# Altium project 5_Volts_and_3.3_Volts_Power_Supply.PrjPcb
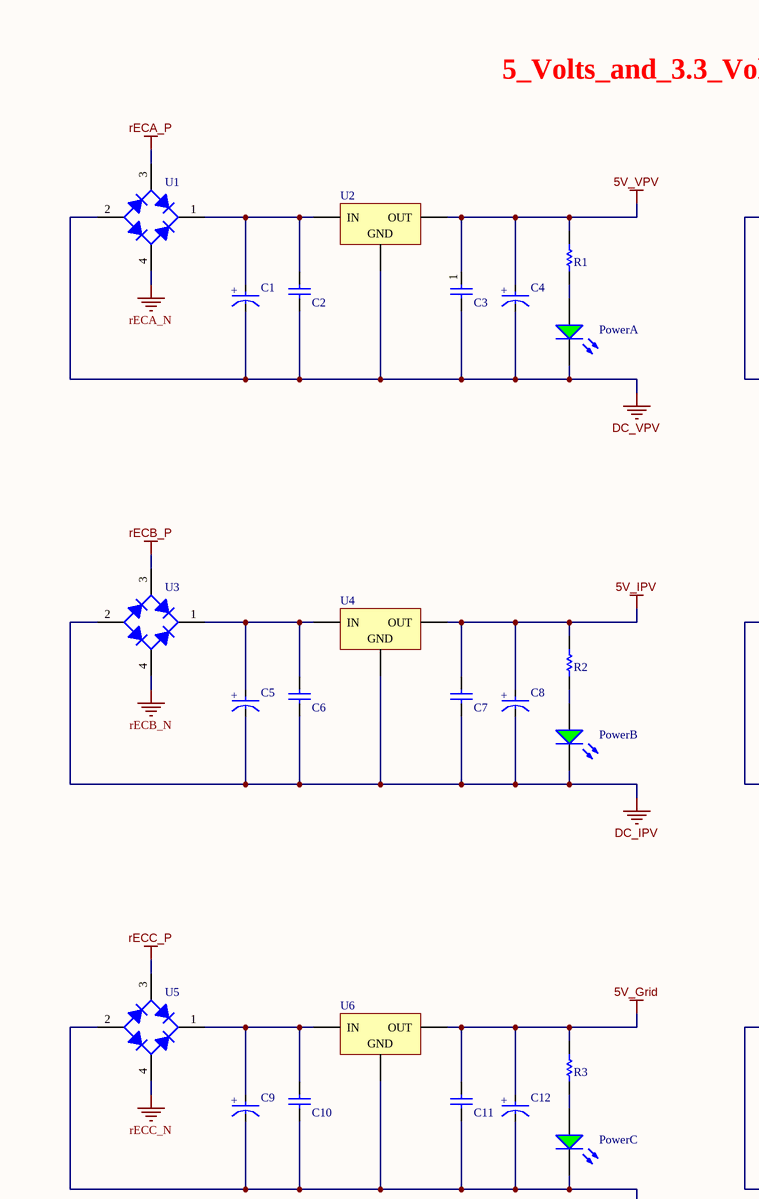
[diagram p0: 5_Volts_and_3.3_Volts_Power_Supply.SchDoc, top left]
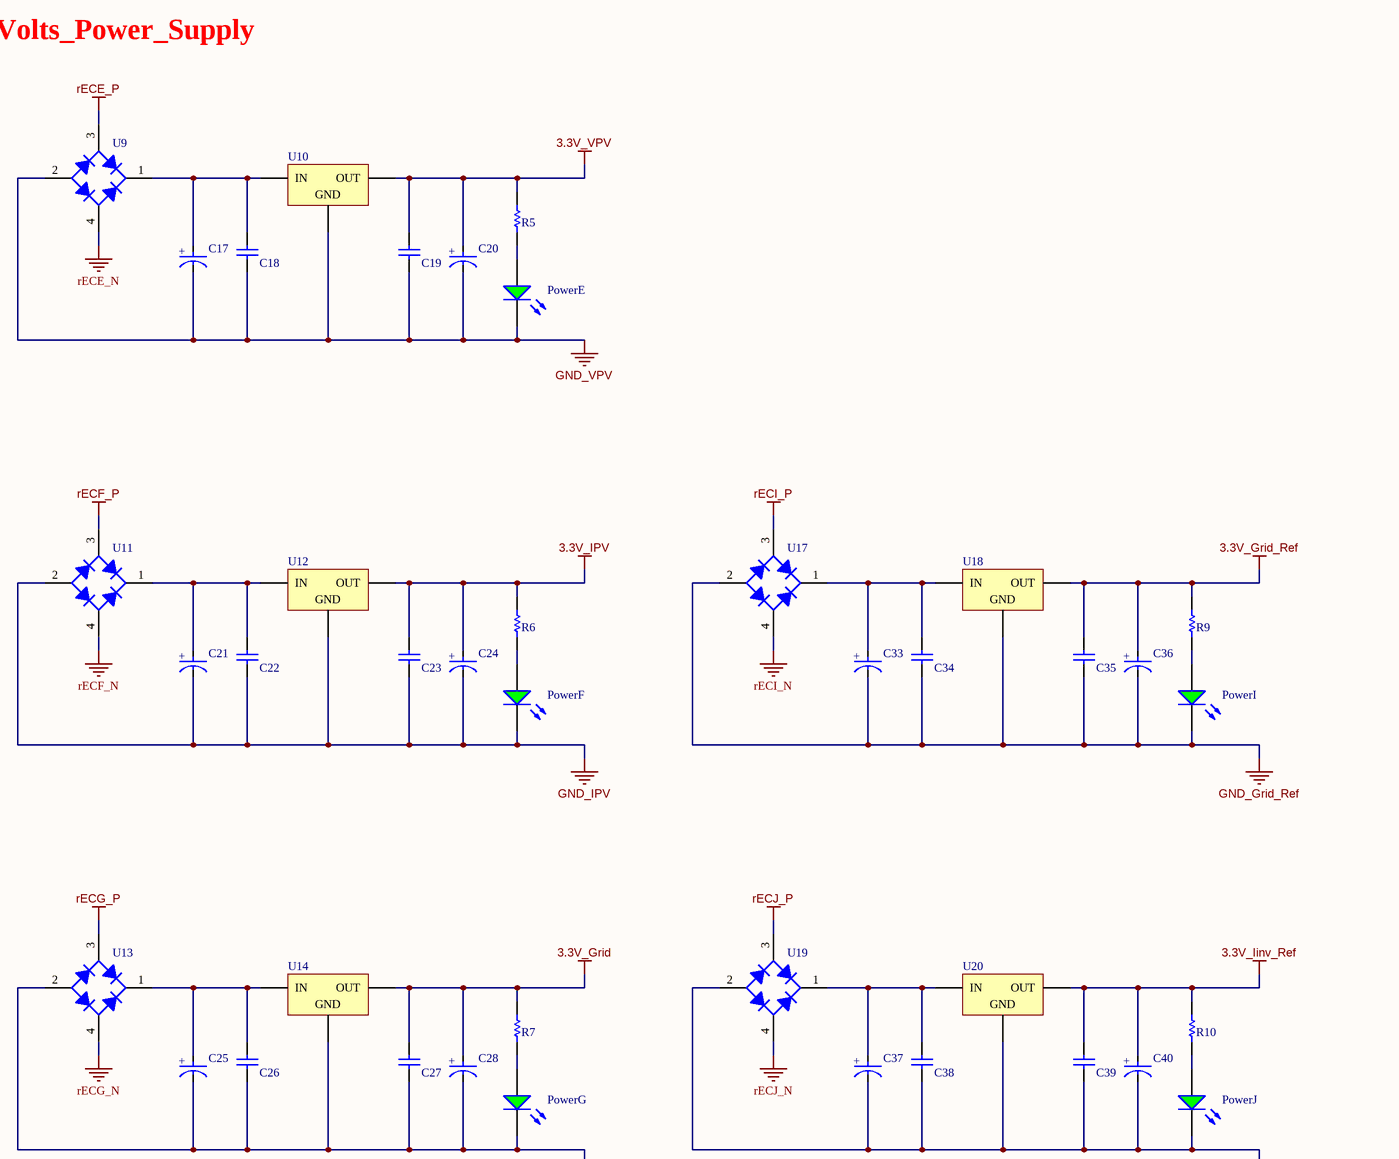
[diagram p1: 5_Volts_and_3.3_Volts_Power_Supply.SchDoc, top right]
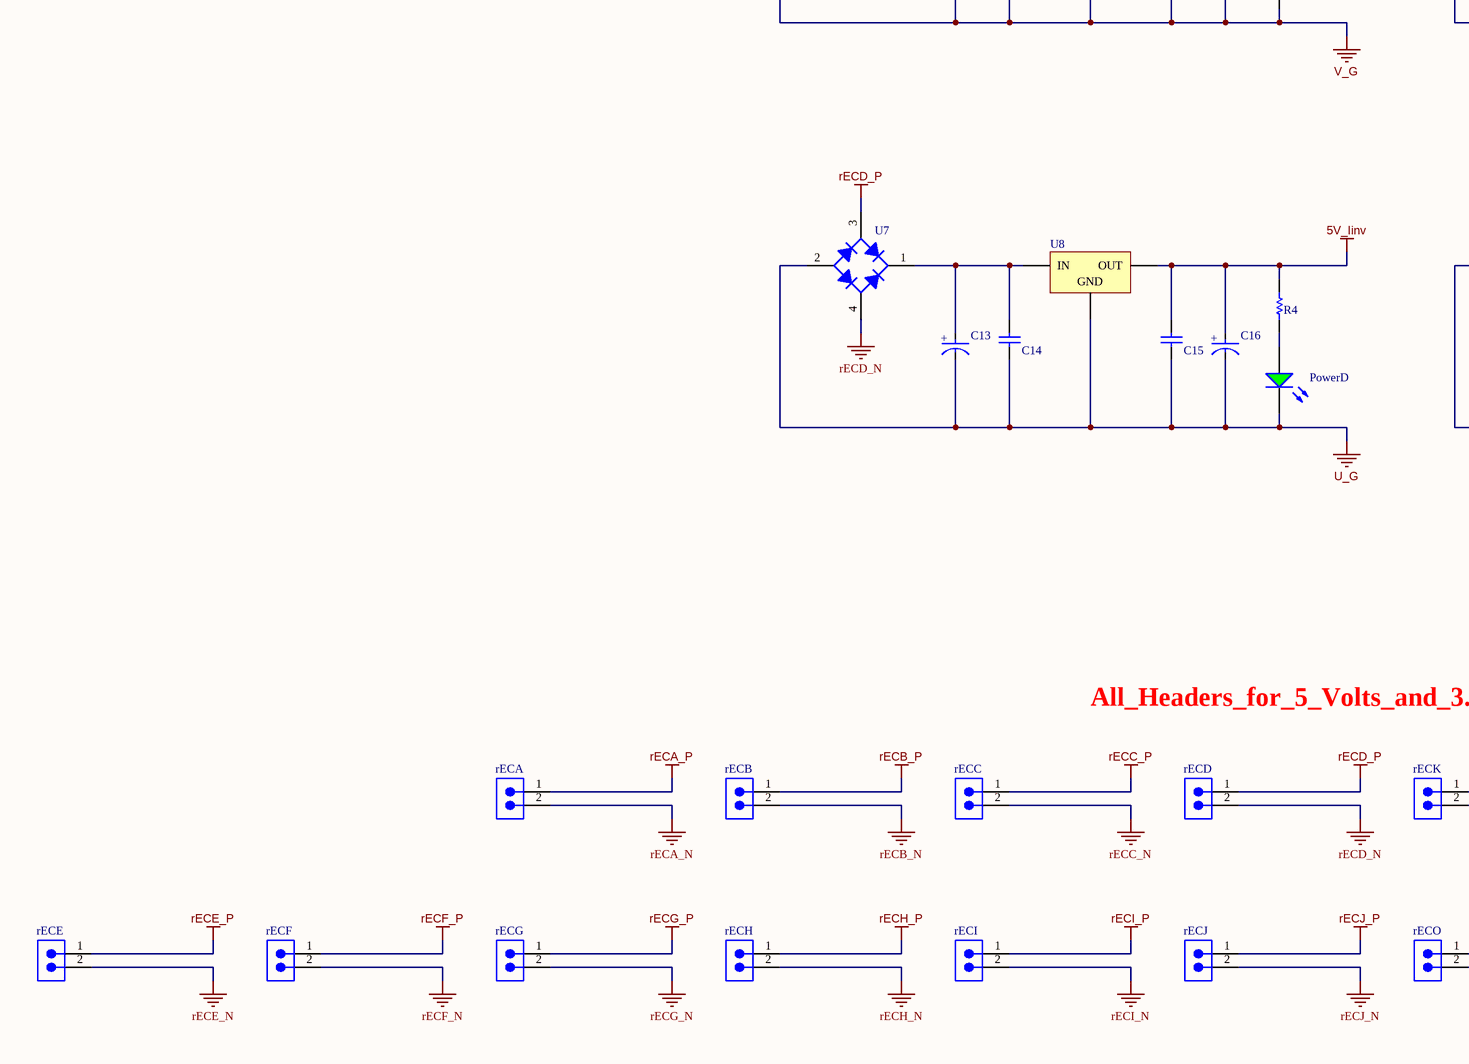
[diagram p2: 5_Volts_and_3.3_Volts_Power_Supply.SchDoc, bottom left]
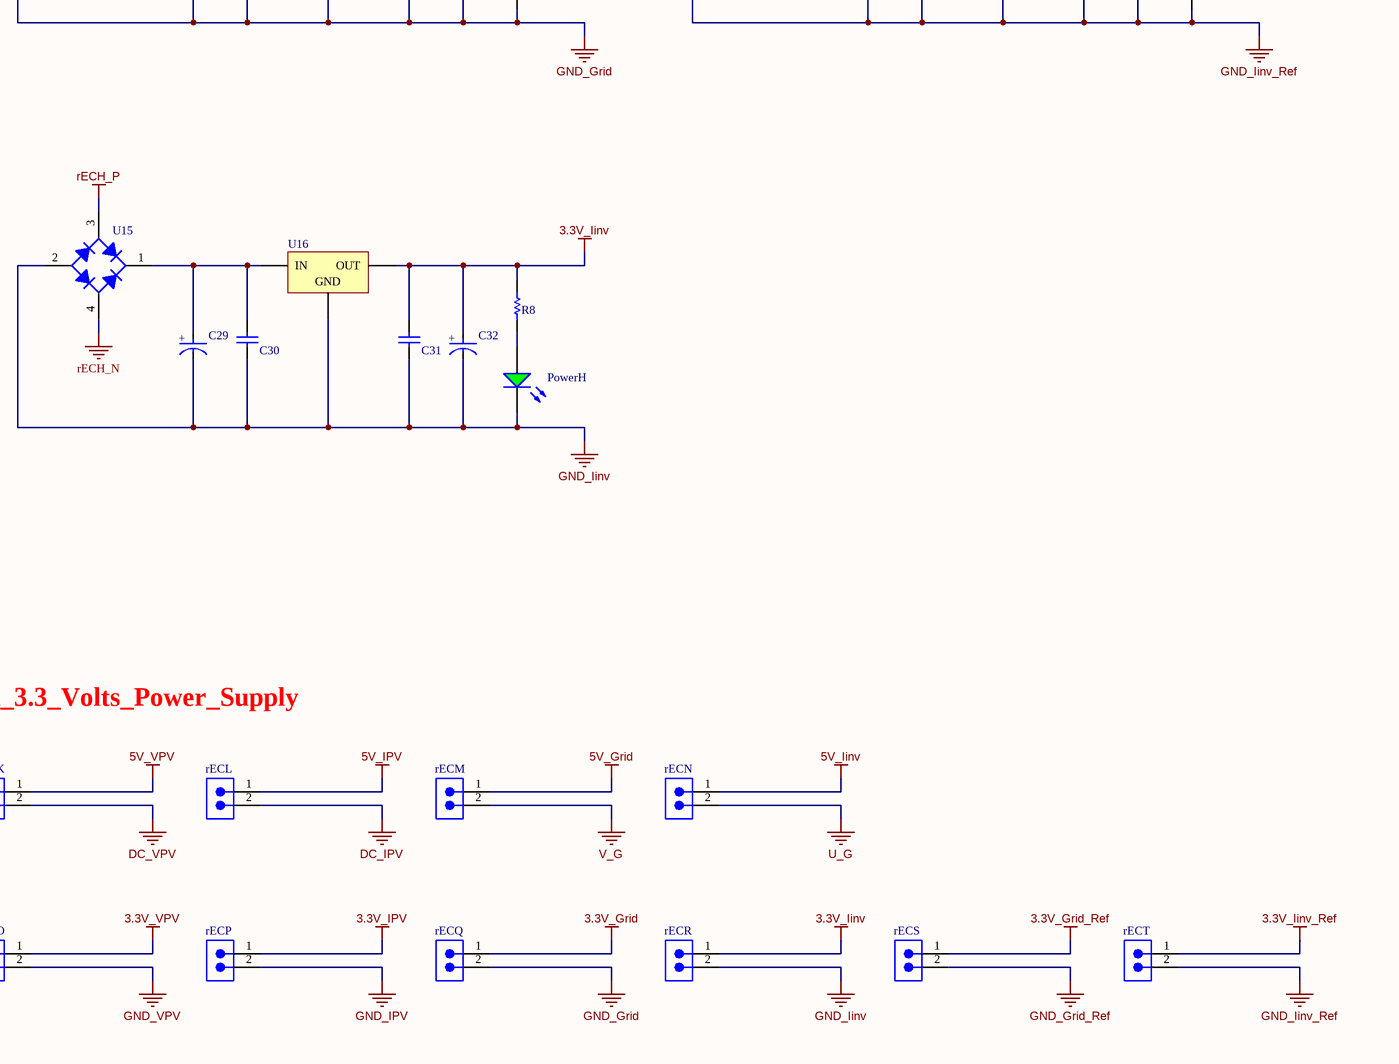
[diagram p3: 5_Volts_and_3.3_Volts_Power_Supply.SchDoc, bottom right]
1 sheet, 100 parts. Net scope: global (net labels, ports and power ports of the same name join across sheets).
Board file: 5_Volts_and_3.3_Volts_Power_Supply.PcbDoc

## Sheet 5_Volts_and_3.3_Volts_Power_Supply.SchDoc
size A1; SheetNumber: 1; SheetTotal: 1

### Parts
C1  EEE-FK1H471AM  [FP-FKJ16-MFG]  (value not drawn)
C2  GRM219R71H334KA88D  [CAPC2013X95X45ML10T25]  (value not drawn)
C3  GRM21BR71H104KA01L  [CAPC2013X135X45ML10T25]  (value not drawn)
C4  EEE-FK1H100UR  [FP-FKC-MFG]  (value not drawn)
C5  EEE-FK1H471AM  [FP-FKJ16-MFG]  (value not drawn)
C6  GRM219R71H334KA88D  [CAPC2013X95X45ML10T25]  (value not drawn)
C7  GRM21BR71H104KA01L  [CAPC2013X135X45ML10T25]  (value not drawn)
C8  EEE-FK1H100UR  [FP-FKC-MFG]  (value not drawn)
C9  EEE-FK1H471AM  [FP-FKJ16-MFG]  (value not drawn)
C10  GRM219R71H334KA88D  [CAPC2013X95X45ML10T25]  (value not drawn)
C11  GRM21BR71H104KA01L  [CAPC2013X135X45ML10T25]  (value not drawn)
C12  EEE-FK1H100UR  [FP-FKC-MFG]  (value not drawn)
C13  EEE-FK1H471AM  [FP-FKJ16-MFG]  (value not drawn)
C14  GRM219R71H334KA88D  [CAPC2013X95X45ML10T25]  (value not drawn)
C15  GRM21BR71H104KA01L  [CAPC2013X135X45ML10T25]  (value not drawn)
C16  EEE-FK1H100UR  [FP-FKC-MFG]  (value not drawn)
C17  EEE-FK1H471AM  [FP-FKJ16-MFG]  (value not drawn)
C18  GRM219R71H334KA88D  [CAPC2013X95X45ML10T25]  (value not drawn)
C19  GRM21BR71H104KA01L  [CAPC2013X135X45ML10T25]  (value not drawn)
C20  EEE-FK1H100UR  [FP-FKC-MFG]  (value not drawn)
C21  EEE-FK1H471AM  [FP-FKJ16-MFG]  (value not drawn)
C22  GRM219R71H334KA88D  [CAPC2013X95X45ML10T25]  (value not drawn)
C23  GRM21BR71H104KA01L  [CAPC2013X135X45ML10T25]  (value not drawn)
C24  EEE-FK1H100UR  [FP-FKC-MFG]  (value not drawn)
C25  EEE-FK1H471AM  [FP-FKJ16-MFG]  (value not drawn)
C26  GRM219R71H334KA88D  [CAPC2013X95X45ML10T25]  (value not drawn)
C27  GRM21BR71H104KA01L  [CAPC2013X135X45ML10T25]  (value not drawn)
C28  EEE-FK1H100UR  [FP-FKC-MFG]  (value not drawn)
C29  EEE-FK1H471AM  [FP-FKJ16-MFG]  (value not drawn)
C30  GRM219R71H334KA88D  [CAPC2013X95X45ML10T25]  (value not drawn)
C31  GRM21BR71H104KA01L  [CAPC2013X135X45ML10T25]  (value not drawn)
C32  EEE-FK1H100UR  [FP-FKC-MFG]  (value not drawn)
C33  EEE-FK1H471AM  [FP-FKJ16-MFG]  (value not drawn)
C34  GRM219R71H334KA88D  [CAPC2013X95X45ML10T25]  (value not drawn)
C35  GRM21BR71H104KA01L  [CAPC2013X135X45ML10T25]  (value not drawn)
C36  EEE-FK1H100UR  [FP-FKC-MFG]  (value not drawn)
C37  EEE-FK1H471AM  [FP-FKJ16-MFG]  (value not drawn)
C38  GRM219R71H334KA88D  [CAPC2013X95X45ML10T25]  (value not drawn)
C39  GRM21BR71H104KA01L  [CAPC2013X135X45ML10T25]  (value not drawn)
C40  EEE-FK1H100UR  [FP-FKC-MFG]  (value not drawn)
PowerA  150080GS75000  [WL-SMCW_0805_150080xx75000]  (value not drawn)
PowerB  150080GS75000  [WL-SMCW_0805_150080xx75000]  (value not drawn)
PowerC  150080GS75000  [WL-SMCW_0805_150080xx75000]  (value not drawn)
PowerD  150080GS75000  [WL-SMCW_0805_150080xx75000]  (value not drawn)
PowerE  150080GS75000  [WL-SMCW_0805_150080xx75000]  (value not drawn)
PowerF  150080GS75000  [WL-SMCW_0805_150080xx75000]  (value not drawn)
PowerG  150080GS75000  [WL-SMCW_0805_150080xx75000]  (value not drawn)
PowerH  150080GS75000  [WL-SMCW_0805_150080xx75000]  (value not drawn)
PowerI  150080GS75000  [WL-SMCW_0805_150080xx75000]  (value not drawn)
PowerJ  150080GS75000  [WL-SMCW_0805_150080xx75000]  (value not drawn)
R1  ERJ-6ENF1001V  [RESC2013X70X40ML20T20]  (value not drawn)
R2  ERJ-6ENF1001V  [RESC2013X70X40ML20T20]  (value not drawn)
R3  ERJ-6ENF1001V  [RESC2013X70X40ML20T20]  (value not drawn)
R4  ERJ-6ENF1001V  [RESC2013X70X40ML20T20]  (value not drawn)
R5  ERJ-6ENF1001V  [RESC2013X70X40ML20T20]  (value not drawn)
R6  ERJ-6ENF1001V  [RESC2013X70X40ML20T20]  (value not drawn)
R7  ERJ-6ENF1001V  [RESC2013X70X40ML20T20]  (value not drawn)
R8  ERJ-6ENF1001V  [RESC2013X70X40ML20T20]  (value not drawn)
R9  ERJ-6ENF1001V  [RESC2013X70X40ML20T20]  (value not drawn)
R10  ERJ-6ENF1001V  [RESC2013X70X40ML20T20]  (value not drawn)
rECA  61900211121  [61900211121]  (value not drawn)
rECB  61900211121  [61900211121]  (value not drawn)
rECC  61900211121  [61900211121]  (value not drawn)
rECD  61900211121  [61900211121]  (value not drawn)
rECE  61900211121  [61900211121]  (value not drawn)
rECF  61900211121  [61900211121]  (value not drawn)
rECG  61900211121  [61900211121]  (value not drawn)
rECH  61900211121  [61900211121]  (value not drawn)
rECI  61900211121  [61900211121]  (value not drawn)
rECJ  61900211121  [61900211121]  (value not drawn)
rECK  61900211121  [61900211121]  (value not drawn)
rECL  61900211121  [61900211121]  (value not drawn)
rECM  61900211121  [61900211121]  (value not drawn)
rECN  61900211121  [61900211121]  (value not drawn)
rECO  61900211121  [61900211121]  (value not drawn)
rECP  61900211121  [61900211121]  (value not drawn)
rECQ  61900211121  [61900211121]  (value not drawn)
rECR  61900211121  [61900211121]  (value not drawn)
rECS  61900211121  [61900211121]  (value not drawn)
rECT  61900211121  [61900211121]  (value not drawn)
U1  DF10S  [FAIR-SDIP-4_V]  (value not drawn)
U2  L78M05CDT-TR  [TO-252_L]  (value not drawn)
U3  DF10S  [FAIR-SDIP-4_V]  (value not drawn)
U4  L78M05CDT-TR  [TO-252_L]  (value not drawn)
U5  DF10S  [FAIR-SDIP-4_V]  (value not drawn)
U6  L78M05CDT-TR  [TO-252_L]  (value not drawn)
U7  DF10S  [FAIR-SDIP-4_V]  (value not drawn)
U8  L78M05CDT-TR  [TO-252_L]  (value not drawn)
U9  DF10S  [FAIR-SDIP-4_V]  (value not drawn)
U10  LF33ABDT-TR  [TO-252_N]  (value not drawn)
U11  DF10S  [FAIR-SDIP-4_V]  (value not drawn)
U12  LF33ABDT-TR  [TO-252_N]  (value not drawn)
U13  DF10S  [FAIR-SDIP-4_V]  (value not drawn)
U14  LF33ABDT-TR  [TO-252_N]  (value not drawn)
U15  DF10S  [FAIR-SDIP-4_V]  (value not drawn)
U16  LF33ABDT-TR  [TO-252_N]  (value not drawn)
U17  DF10S  [FAIR-SDIP-4_V]  (value not drawn)
U18  LF33ABDT-TR  [TO-252_N]  (value not drawn)
U19  DF10S  [FAIR-SDIP-4_V]  (value not drawn)
U20  LF33ABDT-TR  [TO-252_N]  (value not drawn)

### Nets
3.3V_Grid: C27.1 C28.2(A) R7.1 rECQ.1 U14.3(OUT)
3.3V_Grid_Ref: C35.1 C36.2(A) R9.1 rECS.1 U18.3(OUT)
3.3V_Iinv: C31.1 C32.2(A) R8.1 rECR.1 U16.3(OUT)
3.3V_Iinv_Ref: C39.1 C40.2(A) R10.1 rECT.1 U20.3(OUT)
3.3V_IPV: C23.1 C24.2(A) R6.1 rECP.1 U12.3(OUT)
3.3V_VPV: C19.1 C20.2(A) R5.1 rECO.1 U10.3(OUT)
5V_Grid: C11.1 C12.2(A) R3.1 rECM.1 U6.3(OUT)
5V_Iinv: C15.1 C16.2(A) R4.1 rECN.1 U8.3(OUT)
5V_IPV: C7.1 C8.2(A) R2.1 rECL.1 U4.3(OUT)
5V_VPV: C3.1 C4.2(A) R1.1 rECK.1 U2.3(OUT)
DC_IPV: C5.1(C) C6.2 C7.2 C8.1(C) PowerB.1(K) rECL.2 U3.2(A) U4.4(GND)
DC_VPV: C1.1(C) C2.2 C3.2 C4.1(C) PowerA.1(K) rECK.2 U1.2(A) U2.4(GND)
GND_Grid: C25.1(C) C26.2 C27.2 C28.1(C) PowerG.1(K) rECQ.2 U13.2(A) U14.4(GND)
GND_Grid_Ref: C33.1(C) C34.2 C35.2 C36.1(C) PowerI.1(K) rECS.2 U17.2(A) U18.4(GND)
GND_Iinv: C29.1(C) C30.2 C31.2 C32.1(C) PowerH.1(K) rECR.2 U15.2(A) U16.4(GND)
GND_Iinv_Ref: C37.1(C) C38.2 C39.2 C40.1(C) PowerJ.1(K) rECT.2 U19.2(A) U20.4(GND)
GND_IPV: C21.1(C) C22.2 C23.2 C24.1(C) PowerF.1(K) rECP.2 U11.2(A) U12.4(GND)
GND_VPV: C17.1(C) C18.2 C19.2 C20.1(C) PowerE.1(K) rECO.2 U9.2(A) U10.4(GND)
rECA_N: rECA.2 U1.4(C)
rECA_P: rECA.1 U1.3(C)
rECB_N: rECB.2 U3.4(C)
rECB_P: rECB.1 U3.3(C)
rECC_N: rECC.2 U5.4(C)
rECC_P: rECC.1 U5.3(C)
rECD_N: rECD.2 U7.4(C)
rECD_P: rECD.1 U7.3(C)
rECE_N: rECE.2 U9.4(C)
rECE_P: rECE.1 U9.3(C)
rECF_N: rECF.2 U11.4(C)
rECF_P: rECF.1 U11.3(C)
rECG_N: rECG.2 U13.4(C)
rECG_P: rECG.1 U13.3(C)
rECH_N: rECH.2 U15.4(C)
rECH_P: rECH.1 U15.3(C)
rECI_N: rECI.2 U17.4(C)
rECI_P: rECI.1 U17.3(C)
rECJ_N: rECJ.2 U19.4(C)
rECJ_P: rECJ.1 U19.3(C)
U_G: C13.1(C) C14.2 C15.2 C16.1(C) PowerD.1(K) rECN.2 U7.2(A) U8.4(GND)
V_G: C9.1(C) C10.2 C11.2 C12.1(C) PowerC.1(K) rECM.2 U5.2(A) U6.4(GND)
NetC1_2: C1.2(A) C2.1 U1.1(K) U2.1(IN)
NetC5_2: C5.2(A) C6.1 U3.1(K) U4.1(IN)
NetC9_2: C9.2(A) C10.1 U5.1(K) U6.1(IN)
NetC13_2: C13.2(A) C14.1 U7.1(K) U8.1(IN)
NetC17_2: C17.2(A) C18.1 U9.1(K) U10.1(IN)
NetC21_2: C21.2(A) C22.1 U11.1(K) U12.1(IN)
NetC25_2: C25.2(A) C26.1 U13.1(K) U14.1(IN)
NetC29_2: C29.2(A) C30.1 U15.1(K) U16.1(IN)
NetC33_2: C33.2(A) C34.1 U17.1(K) U18.1(IN)
NetC37_2: C37.2(A) C38.1 U19.1(K) U20.1(IN)
NetPowerA_2: PowerA.2(A) R1.2
NetPowerB_2: PowerB.2(A) R2.2
NetPowerC_2: PowerC.2(A) R3.2
NetPowerD_2: PowerD.2(A) R4.2
NetPowerE_2: PowerE.2(A) R5.2
NetPowerF_2: PowerF.2(A) R6.2
NetPowerG_2: PowerG.2(A) R7.2
NetPowerH_2: PowerH.2(A) R8.2
NetPowerI_2: PowerI.2(A) R9.2
NetPowerJ_2: PowerJ.2(A) R10.2

### Notes on the sheet
- 5_Volts_and_3.3_Volts_Power_Supply
- All_Headers_for_5_Volts_and_3.3_Volts_Power_Supply
- (in symbol CMP-05427-000030-1) +
- (in symbol CMP-05427-002167-1) +

### Library data of the parts
C1 C5 C9 C13 C17 C21 C25 C29 C33 C37 = CMP-05427-002167-1: CAP ALUM 470UF 20% 50V SMD; Impedance: 73mR; Ripple Current: 1.61A; Polarity: Polar; Life (Hours): 5000Hour; Dissipation Factor: 0.12%; Height - Seated (Max): 0.669inch; Reach SVHC Compliant: Yes; Termination: SMD/SMT; Mount: Surface Mount; Voltage: 50V; Ratings: AEC-Q200; Series: FK; Tolerance: 20%; ESR (Equivalent Series Resistance): 73mR; Construction: Cylindrical; Length: 16.5mm; Lead Free: Lead Free; Radiation Hardening: No; Package Quantity: 125; Min Operating Temperature: -55°C; Case/Package: Radial; Capacitance: 470uF; Ripple Current (AC): 1.61A; Diameter: 16mm; Voltage Rating (DC): 50V; Height: 16.5mm; Packaging: Tape and Reel; Max Operating Temperature: 105°C; Voltage Rating: 50V; RoHS Compliant: Yes
C2 C6 C10 C14 C18 C22 C26 C30 C34 C38 = CMP-1036-04606-2: Multilayer Ceramic Capacitor, 0.33 uF, 50 V, ï¿½ 10%, X7R, 0805 [2012 Metric]; Manufacturer: Murata; Part Number: GRM219R71H334KA88D
C3 C7 C11 C15 C19 C23 C27 C31 C35 C39 = CMP-2100-03644-1: Chip Capacitor, 0.1 uF, +/- 10%, 50 V, -55 to 125 degC, 0805 (2012 Metric), RoHS, Tape and Reel; Manufacturer: Murata; Voltage: 50V; Capacitance: 100nF; Insulation Resistance: 10GR; Dielectric Material: Ceramic; Dielectric: X7R; Package Description: 2-Pin Surface Mount Device, Body 2 x 1.25 mm; Manufacturer URL: http://www.murata.com/; Case Code (Imperial): 0805; Datasheet URL: http://psearch.en.murata.com/capacitor/product/GRM21BR71H104KA01%23.pdf; Termination: SMD/SMT; Lead Free: LeadFree; Package Quantity: 1; Mount: SurfaceMount; REACH SVHC: Unknown; Thickness: 0.053inch; Height: 1.25mm; Case/Package: 0805; Voltage Rating: 50V; Width: 0.049inch; Case Code (Metric): 2012; Material: Ceramic; Min Operating Temperature: -55degC; RoHSCompliant: true; Datasheet Version: 42675.0; Voltage Rating (DC): 50V; Tolerance: 10%; Package Reference: 0805; Depth: 1.25mm; Length: 2mm; Max Operating Temperature: 125degC; Packaging: TapeandReel; Number of Pins: 2; Radiation Hardening: No
C4 C8 C12 C16 C20 C24 C28 C32 C36 C40 = CMP-05427-000030-1: CAP ALUM 10UF 20% 50V SMD; Impedance: 1.52R; Ripple Current (AC): 85mA; Life (Hours): 2000Hour; Leakage Current: 3uA; Dielectric Material: Aluminium; Length: 5.8mm; Voltage Rating: 50V; Radiation Hardening: No; Max Operating Temperature: 105°C; REACH SVHC: No SVHC; Tolerance: 20%; RoHS Compliant: Yes; Case/Package: Radial; Height: 5.8mm; Voltage: 50V; Diameter: 5mm; Number of Pins: 2; Ripple Current: 85mA; Series: FK; Lead Free: Lead Free; Width: 6.5mm; ESR (Equivalent Series Resistance): 1.52R; Package Quantity: 1000; Construction: Cylindrical; Voltage Rating (DC): 50V; Packaging: Tape and Reel; Height - Seated (Max): 0.228inch; Contact Plating: Tin; Capacitance: 10uF; Min Operating Temperature: -55°C; Termination: SMD/SMT; Material: Aluminium; Mount: Surface Mount
PowerA PowerB PowerC PowerD PowerE PowerF PowerG PowerH PowerI PowerJ = CMP-1426-00007-2: WURTH ELEKTRONIK - 150080GS75000 - LED, Green, SMD, 0805, 30 mA, 3.2 V, 520 nm; NexarPartId: 29717780; Wavelength: 520nm; Forward Current: 100mA; Lens Style: Clear, Rectangular; Dominant Wavelength: 525nm; Max Junction Temperature (Tj): 95°C; Power Dissipation: 105mW; Luminous Intensity: 450mcd; Peak Wavelength: 515nm; Viewing Angle: 140°; Test Current: 20mA; Reverse Voltage: 5V; Forward Voltage: 3.2V; Mount: Surface Mount; REACH SVHC: Unknown; Min Operating Temperature: -40°C; Case Code (Imperial): 0805; Case/Package: 0805; Max Operating Temperature: 85°C; RoHS: Compliant; Length: 2mm; Height: 700µm; Width: 1.25mm; Color: Green; Case Code (Metric): 2012; Packaging: Tape and Reel; Max Reverse Voltage (DC): 5V
R1-R10 = CMP-2001-04375-5: Chip Resistor, 1 KOhm, +/- 1%, 0.125 W, -55 to 155 degC, 0805 (2012 Metric), RoHS, Tape and Reel; Manufacturer: Panasonic; Voltage Rating: 150 V; ComponentLink1URL: http://www.panasonic.com/; ComponentLink2Description: Datasheet; REACH SVHC: Yes; ComponentLink1Description: Manufacturer URL; Length: 2 mm; Height: 0.6 mm; Package Quantity: 1; PackageDescription: 2-Pin Surface Mount Device, Body 2 x 1.25 mm; Packaging: Cut Tape; PackageReference: 0805; Max Operating Temperature: 155 degC; Mounting Technology: Surface Mount; ComponentLink2URL: http://industrial.panasonic.com/cdbs/www-data/pdf/RDA0000/AOA0000C86.pdf; DatasheetVersion: 04/2015; Min Operating Temperature: -55 degC; RoHSCompliant: true; Mount: Surface Mount
rECA rECB rECC rECD rECE rECF rECG rECH rECI rECJ rECK rECL rECM rECN rECO rECP rECQ rECR rECS rECT = CMP-1502-00584-3: 2 Position 2.54mm Pitch Vertical ThroughHole Non-Shrouded Header; NexarPartId: 18818218; Gender: Male; Connector Type: Male Pin; Insulation Resistance: 1GΩ; Contact Resistance: 20mΩ; Number of Contacts: 2; Operating Supply Voltage: 250V; Current Rating: 3A; Color: Beige; Fastening Type: Friction; Number of Pins: 2; Lead Pitch: 2.54mm; Orientation: Vertical; Max Operating Temperature: 105°C; Contact Mating Length: 7.493mm; RoHS: Compliant; Voltage Rating: 250V; Number of Positions: 2; Mount: Through Hole; Length: 5.08mm; Contact Plating: Tin; Width: 5.12mm; Termination: Through Hole; Flammability Rating: UL94 V-0; Min Operating Temperature: -40°C; Housing Material: Nylon; Contact Gender: Male; Number of Rows: 1; Packaging: Bulk; REACH SVHC: Unknown; Contact Material: Copper; Pitch: 2.54mm; Height: 11.75mm
U1 U3 U5 U7 U9 U11 U13 U15 U17 U19 = CMP-2000-06153-1: Bridge Rectifier, 1.5 A, 1000 V, 4-Pin SDIP, RoHS, Tape and Reel; Manufacturer: FairchildSemiconductor; Configuration: Single; Peak Average Forward Current: 1.5@Ta=40CA; Peak Reverse Repetitive Voltage: 1000V; Peak Reverse Current: 5uA; Bridge Type: SinglePhase; Peak Forward Voltage: 1.1@1AV; Datasheet Version: Rev. 1.5, 05/2015; Package: 4SDIPSMD; Operating Temperature: -55to150°C; Package Reference: SDIP 4L; Datasheet URL: http://www.farnell.com/datasheets/1941063.pdf; Packaging: Tape&Reel; Manufacturer URL: https://www.fairchildsemi.com/; Mounting Technology: SurfaceMount; Category: BridgeRectifier; Package Description: 4-Pin Surface Mount Device, Body 8.28 x 6.35 mm, Pitch 5.1 mm; Mounting: SurfaceMount
U2 U4 U6 U8 = CMP-0244-00178-1: Positive Voltage Regulator, 5V, 3-Pin DPAK, Tape and Reel; PackageReference: TO-252; ComponentLink1URL: http://www.st.com; ComponentLink2Description: Datasheet; PackageDescription: 3-Pin Transistor Outline Package 2.28 mm Pitch, 9.7 mm Lead Span (DPAK); ComponentLink1Description: Manufacturer URL; DatasheetVersion: 1/11/2010; ComponentLink2URL: http://www.st.com/internet/com/TECHNICAL_RESOURCES/TECHNICAL_LITERATURE/DATASHEET/CD00000447.pdf; PackageVersion: 2011
U10 U12 U14 U16 U18 U20 = CMP-0244-00064-1: 500mA, Very Low Drop (0.45V) Voltage Regulator, 3.3V, 3-Pin DPAK, Tape and Reel; ComponentLink2Description: Datasheet; PackageDescription: 3-Pin Transistor Outline Package 2.28 mm Pitch, 9.7 mm Lead Span (DPAK); DatasheetVersion: 1/11/2010; ComponentLink1Description: Manufacturer URL; ComponentLink2URL: http://www.st.com/internet/com/TECHNICAL_RESOURCES/TECHNICAL_LITERATURE/DATASHEET/CD00000546.pdf; ComponentLink1URL: http://www.st.com; PackageVersion: 2011; PackageReference: TO-252